# EAGLE design uO_c (EAGLE 7.5.0)
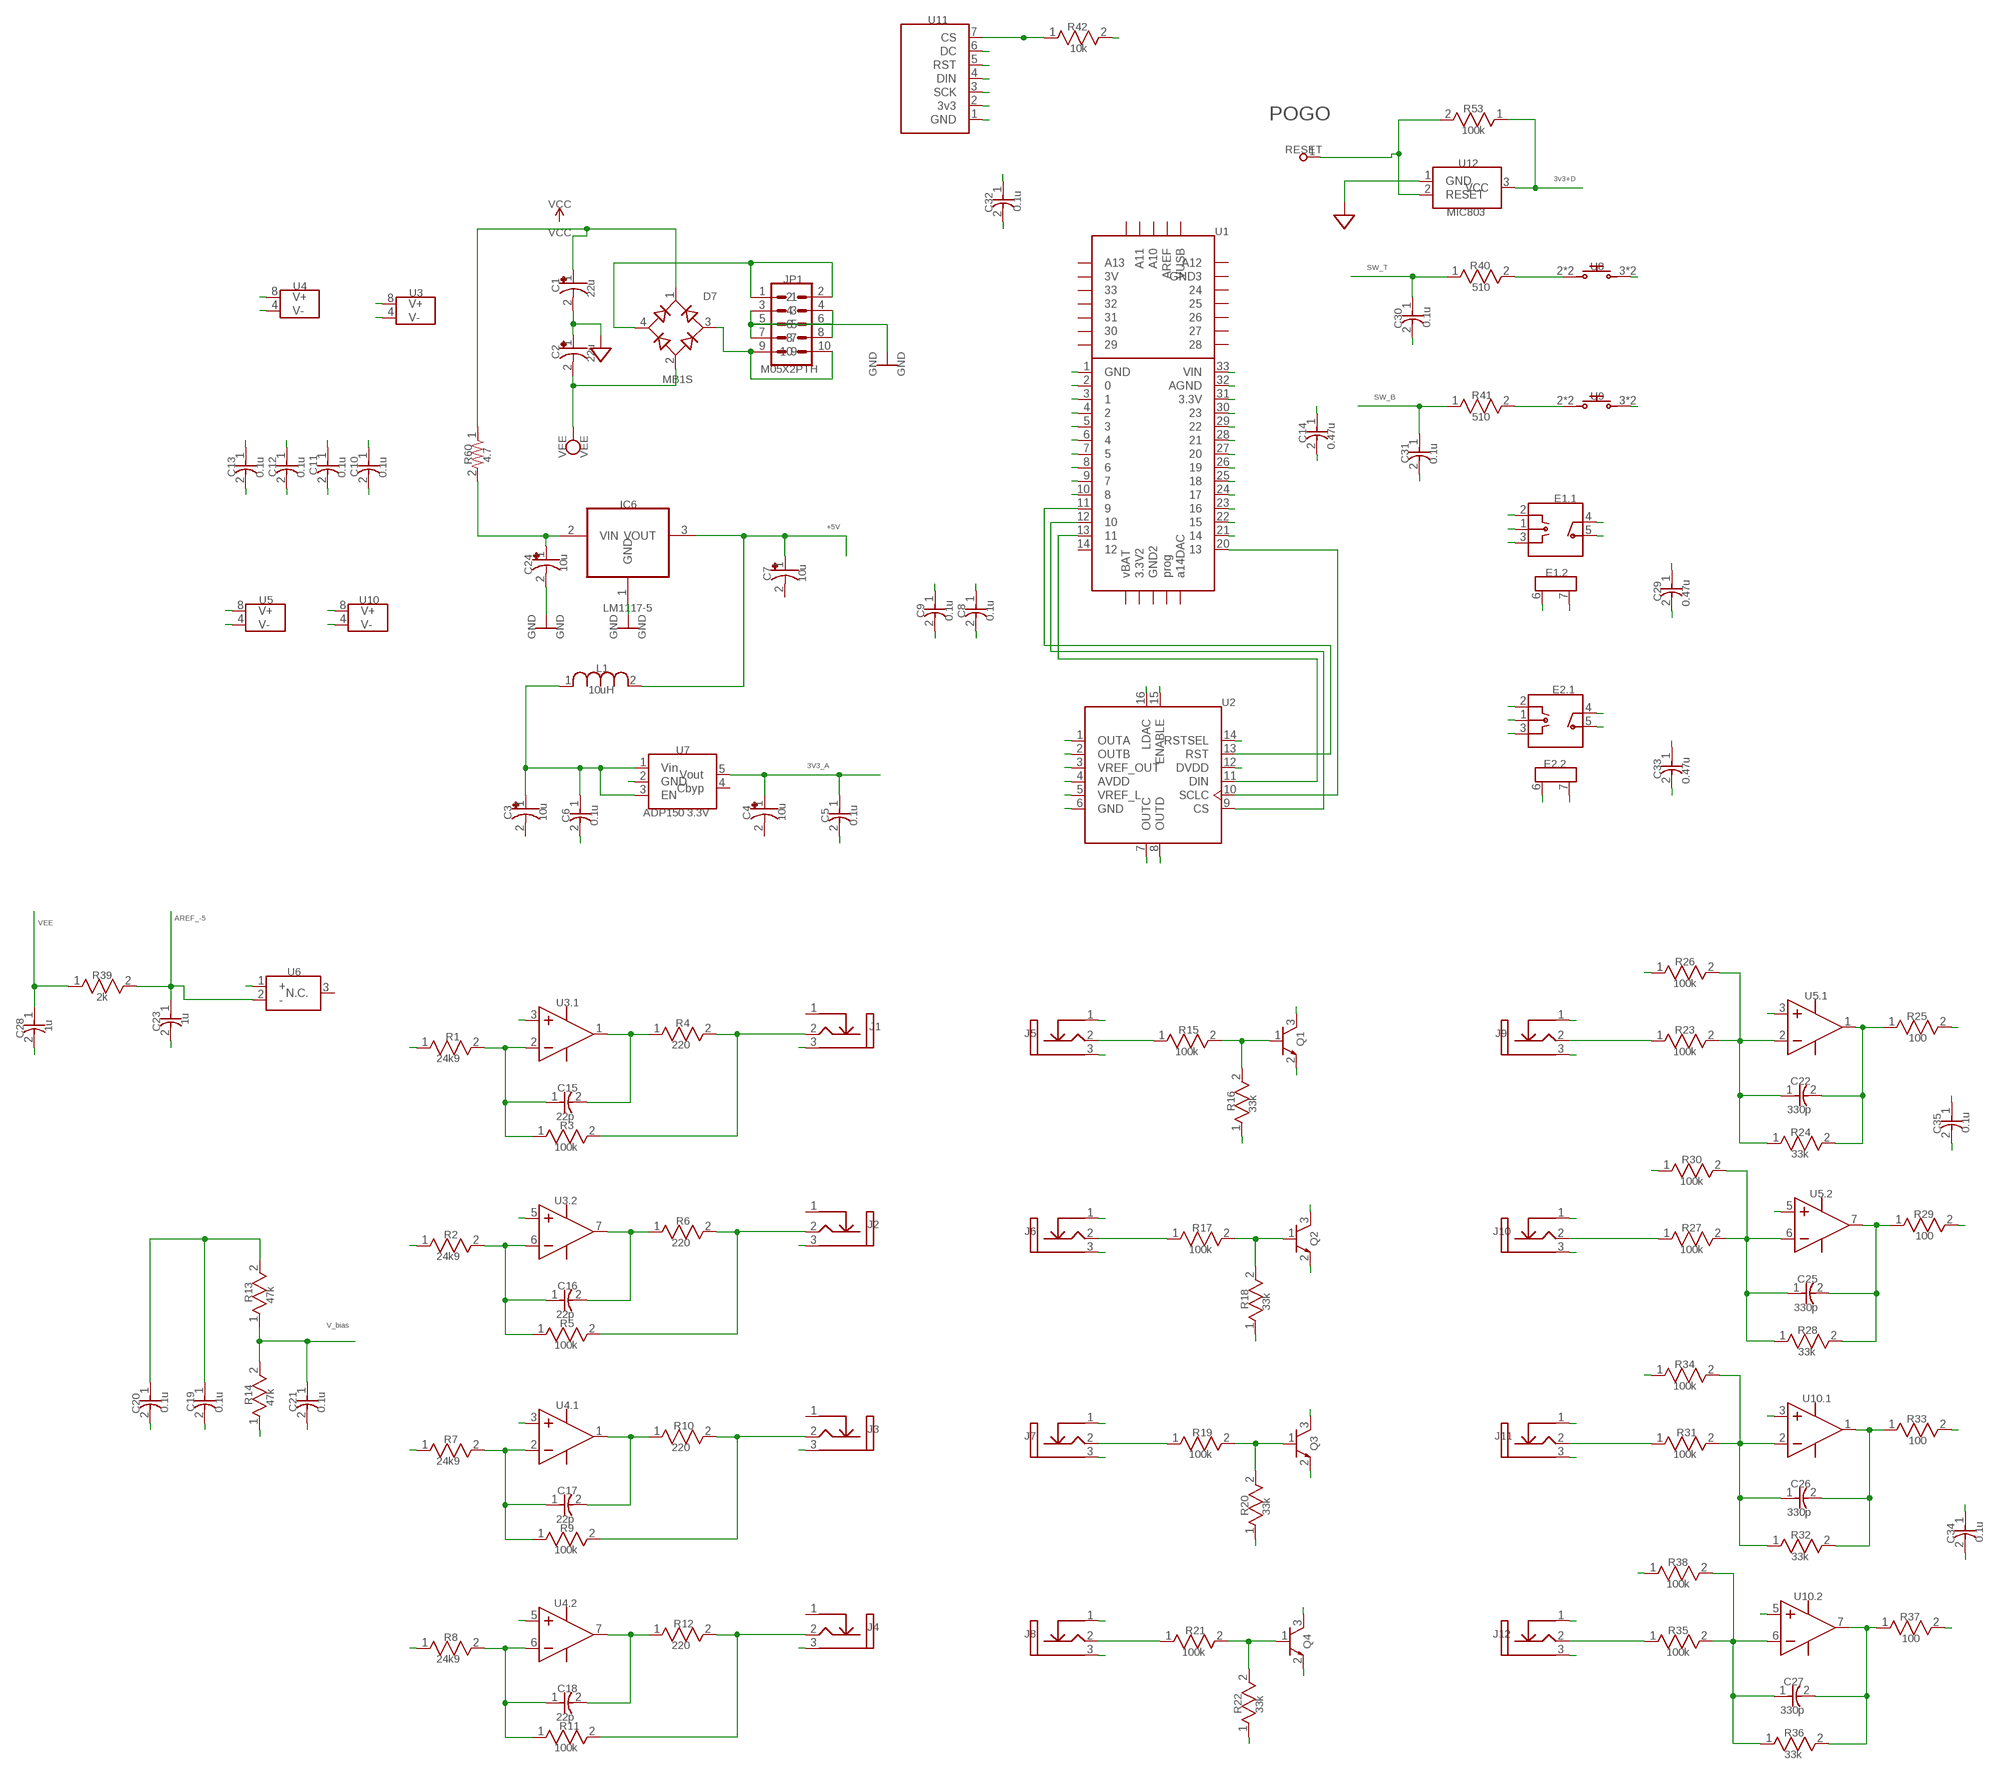
[diagram p0: schematic, sheet 1]

## Parts
C1  22u  CPOL-USC  [CAPAE-5.3X5.3H3]
C2  22u  CPOL-USC  [CAPAE-5.3X5.3H3]
C3  10u  CPOL-USC  [CAPAE-5.3X5.3H3]
C4  10u  CPOL-USC  [CAPAE-5.3X5.3H3]
C5  0.1u  CAP_0805  [CAP_0805]
C6  0.1u  CAP_0805  [CAP_0805]
C7  10u  CPOL-USC  [CAPAE-5.3X5.3H3]
C8  0.1u  CAP_0805  [CAP_0805]
C9  0.1u  CAP_0805  [CAP_0805]
C10  0.1u  CAP_0805  [CAP_0805]
C11  0.1u  CAP_0805  [CAP_0805]
C12  0.1u  CAP_0805  [CAP_0805]
C13  0.1u  CAP_0805  [CAP_0805]
C14  0.47u  CAP_0805  [CAP_0805]
C15  22p  CAP_0805  [CAP_0805]
C16  22p  CAP_0805  [CAP_0805]
C17  22p  CAP_0805  [CAP_0805]
C18  22p  CAP_0805  [CAP_0805]
C19  0.1u  CAP_0805  [CAP_0805]
C20  0.1u  CAP_0805  [CAP_0805]
C21  0.1u  CAP_0805  [CAP_0805]
C22  330p  CAP_0805  [CAP_0805]
C23  1u  CAP_0805  [CAP_0805]
C24  10u  CPOL-USC  [CAPAE-5.3X5.3H3]
C25  330p  CAP_0805  [CAP_0805]
C26  330p  CAP_0805  [CAP_0805]
C27  330p  CAP_0805  [CAP_0805]
C28  1u  CAP_0805  [CAP_0805]
C29  0.47u  CAP_0805  [CAP_0805]
C30  0.1u  CAP_0805  [CAP_0805]
C31  0.1u  CAP_0805  [CAP_0805]
C32  0.1u  CAP_0805  [CAP_0805]
C33  0.47u  CAP_0805  [CAP_0805]
C34  0.1u  CAP_0805  [CAP_0805]
C35  0.1u  CAP_0805  [CAP_0805]
D7  MB1S  [SOP-4/6.5X2.54]
E1  PEC11  [PEC11]
E2  PEC11  [PEC11]
IC6  LM1117-5  REG1117T  [TO252]
J1  THONKICONN  [THONKICONN_JACK]
J2  THONKICONN  [THONKICONN_JACK]
J3  THONKICONN  [THONKICONN_JACK]
J4  THONKICONN  [THONKICONN_JACK]
J5  THONKICONN_20  [THONKICONN_JACK]
J6  THONKICONN_20  [THONKICONN_JACK]
J7  THONKICONN_20  [THONKICONN_JACK]
J8  THONKICONN_20  [THONKICONN_JACK]
J9  THONKICONN_20  [THONKICONN_JACK]
J10  THONKICONN_20  [THONKICONN_JACK]
J11  THONKICONN_20  [THONKICONN_JACK]
J12  THONKICONN_20  [THONKICONN_JACK]
JP1  M05X2PTH  [AVR_ICSP]
L1  10uH  DEV_L1  [RES_1210]
Q1  MMBT3904  [SOT23]
Q2  MMBT3904  [SOT23]
Q3  MMBT3904  [SOT23]
Q4  MMBT3904  [SOT23]
R1  24k9  RES_0805  [RES_0805]
R2  24k9  RES_0805  [RES_0805]
R3  100k  RES_0805  [RES_0805]
R4  220  RES_0805  [RES_0805]
R5  100k  RES_0805  [RES_0805]
R6  220  RES_0805  [RES_0805]
R7  24k9  RES_0805  [RES_0805]
R8  24k9  RES_0805  [RES_0805]
R9  100k  RES_0805  [RES_0805]
R10  220  RES_0805  [RES_0805]
R11  100k  RES_0805  [RES_0805]
R12  220  RES_0805  [RES_0805]
R13  47k  RES_0805  [RES_0805]
R14  47k  RES_0805  [RES_0805]
R15  100k  RES_0805  [RES_0805]
R16  33k  RES_0805  [RES_0805]
R17  100k  RES_0805  [RES_0805]
R18  33k  RES_0805  [RES_0805]
R19  100k  RES_0805  [RES_0805]
R20  33k  RES_0805  [RES_0805]
R21  100k  RES_0805  [RES_0805]
R22  33k  RES_0805  [RES_0805]
R23  100k  RES_0805  [RES_0805]
R24  33k  RES_0805  [RES_0805]
R25  100  RES_0805  [RES_0805]
R26  100k  RES_0805  [RES_0805]
R27  100k  RES_0805  [RES_0805]
R28  33k  RES_0805  [RES_0805]
R29  100  RES_0805  [RES_0805]
R30  100k  RES_0805  [RES_0805]
R31  100k  RES_0805  [RES_0805]
R32  33k  RES_0805  [RES_0805]
R33  100  RES_0805  [RES_0805]
R34  100k  RES_0805  [RES_0805]
R35  100k  RES_0805  [RES_0805]
R36  33k  RES_0805  [RES_0805]
R37  100  RES_0805  [RES_0805]
R38  100k  RES_0805  [RES_0805]
R39  2k  RES_0805  [RES_0805]
R40  510  RES_0805  [RES_0805]
R41  510  RES_0805  [RES_0805]
R42  10k  RES_0805  [RES_0805]
R53  100k  RES_0603  [RES_0805]
R60  4.7  R-US_R1206  [R1206]
RESET  RESET  [ROUND-ROUND]
U1  TEENSY_3.1_EDGE  [TEENSY3.1_EDGE]
U2  DAC8565  [TSSOP-16]
U3  OPA2172  [SOIC-8/150MIL]
U4  OPA2172  [SOIC-8/150MIL]
U5  MCP6002  [SOIC-8/150MIL]
U6  LM4040_EM3-5.0  [SOT23]
U7  ADP150 3.3V  ADP150_3.3V  [SOT23-5]
U8  6MM_TACTILE_SW  [TL1105SP]
U9  6MM_TACTILE_SW  [TL1105SP]
U10  MCP6002  [SOIC-8/150MIL]
U11  1306_DISP_O_C  [1306_DISP_O_C]
U12  MIC803  MIC803_SUPERVISOR  [SOT23]

## Nets
3v3+D: C8.1 C14.1 C32.1 R42.2 R53.1 U1.31(3.3V) U2.12(DVDD) U11.2(3v3) U12.3(VCC)
3V3_A: C4.1(+) C5.1 C9.1 C34.1 C35.1 U2.4(AVDD) U5.8(VCC_AND_GND:V+) U7.5(Vout) U10.8(VCC_AND_GND:V+)
+5V: C7.1(+) IC6.3(VOUT) L1.2 U1.33(VIN)
AREF_-5: C23.1 R26.1 R30.1 R34.1 R38.1 R39.2 U6.2(-)
CS_DAC: U1.12 U2.9(CS)
CS_OLED: R42.1 U1.10 U11.7(CS)
CV_1: R25.2 U1.26
CV_2: R29.2 U1.25
CV_3: R33.2 U1.27
CV_4: R37.2 U1.24
CV_A: R1.1 U2.1(OUTA)
CV_B: R2.1 U2.2(OUTB)
CV_C: R7.1 U2.7(OUTC)
CV_D: R8.1 U2.8(OUTD)
DC: U1.8 U11.6(DC)
DOUT: U1.13 U2.11(DIN) U11.4(DIN)
ENC_L1: E1.2 U1.29
ENC_L2: E1.3 U1.28
ENC_R1: E2.2 U1.22
ENC_R2: E2.3 U1.23
GND [NetClass1]: C1.2(-) C2.1(+) C3.2(-) C4.2(-) C5.2 C6.2 C7.2(-) C8.2 C9.2 C10.2 C11.2 C12.1 C13.1 C14.2 C19.2 C20.2 C21.2 C23.2 C24.2(-) C28.2 C29.2 C30.2 C31.2 C32.2 C33.2 C34.2 C35.2 E1.1 E1.5 E1.6(PART_2:gnd) E1.7(PART_2:gnd) E2.1 E2.5 E2.6(PART_2:gnd) E2.7(PART_2:gnd) IC6.1(GND) J1.3(GND) J2.3(GND) J3.3(GND) J4.3(GND) J5.1(TN) J5.3(GND) J6.1(TN) J6.3(GND) J7.1(TN) J7.3(GND) J8.1(TN) J8.3(GND) J9.1(TN) J9.3(GND) J10.1(TN) J10.3(GND) J11.1(TN) J11.3(GND) J12.1(TN) J12.3(GND) JP1.3 JP1.4 JP1.5 JP1.6 JP1.7 JP1.8 Q1.2((E)) Q2.2((E)) Q3.2((E)) Q4.2((E)) R14.1 R16.1 R18.1 R20.1 R22.1 U1.1(GND) U1.32(AGND) U2.5(VREF_L) U2.6(GND) U2.14(RSTSEL) U2.15(ENABLE) U2.16(LDAC) U5.3(PART_1:IN+) U5.4(VCC_AND_GND:V-) U5.5(PART_2:IN+) U6.1(+) U7.2(GND) U8.3 U8.4 U9.3 U9.4 U10.3(PART_1:IN+) U10.4(VCC_AND_GND:V-) U10.5(PART_2:IN+) U11.1(GND) U12.1(GND) ; supply symbol labelled 22u, GNDANALOG
N$64: D7.3(AC2) JP1.9 JP1.10
Net_0: J2.2(Tip) R5.2 R6.2
Net_1: C16.1 R2.2 R5.1 U3.6(PART_2:IN-)
Net_2: C16.2 R6.1 U3.7(PART_2:OUT)
Net_3: J3.2(Tip) R9.2 R10.2
Net_4: C17.1 R7.2 R9.1 U4.2(PART_1:IN-)
Net_5: C17.2 R10.1 U4.1(PART_1:OUT)
Net_6: J4.2(Tip) R11.2 R12.2
Net_7: C18.1 R8.2 R11.1 U4.6(PART_2:IN-)
Net_8: C18.2 R12.1 U4.7(PART_2:OUT)
Net_9: Q2.1((B)) R17.2 R18.2
Net_10: Q3.1((B)) R19.2 R20.2
Net_11: Q4.1((B)) R21.2 R22.2
Net_12: C25.1 R27.2 R28.1 R30.2 U5.6(PART_2:IN-)
Net_13: C3.1(+) C6.1 L1.1 U7.1(Vin) U7.3(EN)
Net_18: C26.1 R31.2 R32.1 R34.2 U10.2(PART_1:IN-)
Net_19: J1.2(Tip) R3.2 R4.2
Net_20: C15.1 R1.2 R3.1 U3.2(PART_1:IN-)
Net_21: C15.2 R4.1 U3.1(PART_1:OUT)
Net_22: C27.1 R35.2 R36.1 R38.2 U10.6(PART_2:IN-)
Net_35: Q1.1((B)) R15.2 R16.2
Net_39: J8.2(Tip) R21.1
Net_40: J7.2(Tip) R19.1
Net_41: J6.2(Tip) R17.1
Net_42: J5.2(Tip) R15.1
Net_43: C22.1 R23.2 R24.1 R26.2 U5.2(PART_1:IN-)
Net_48: C27.2 R36.2 R37.1 U10.7(PART_2:OUT)
Net_49: C26.2 R32.2 R33.1 U10.1(PART_1:OUT)
Net_50: C25.2 R28.2 R29.1 U5.7(PART_2:OUT)
Net_51: C22.2 R24.2 R25.1 U5.1(PART_1:OUT)
Net_52: J9.2(Tip) R23.1
Net_53: J10.2(Tip) R27.1
Net_54: J11.2(Tip) R31.1
Net_55: J12.2(Tip) R35.1
Net_73: C24.1(+) IC6.2(VIN) R60.2
Net_75: R41.2 U9.1 U9.2
Net_76: R40.2 U8.1 U8.2
Net_88: R53.2 RESET.1 U12.2(RESET)
Net_107: D7.4(AC1) JP1.1 JP1.2
RST: U1.9 U11.5(RST)
RST_DAC: U1.11 U2.13(RST)
SCK: U1.20 U2.10(SCLC) U11.3(SCK)
SW_B: C31.1 R41.1 U1.6
SW_L: C29.1 E1.4 U1.30
SW_R: C33.1 E2.4 U1.21
SW_T: C30.1 R40.1 U1.7
TR1: Q1.3((C)) U1.2
TR2: Q2.3((C)) U1.3
TR3: Q3.3((C)) U1.4
TR4: Q4.3((C)) U1.5
V_bias: C21.1 R13.1 R14.2 U3.3(PART_1:IN+) U3.5(PART_2:IN+) U4.3(PART_1:IN+) U4.5(PART_2:IN+)
VCC: C1.1(+) C10.1 C11.1 D7.1(+) R60.1 U3.8(VCC_AND_GND:V+) U4.8(VCC_AND_GND:V+)
VEE: C2.2(-) C12.2 C13.2 C28.1 D7.2(-) R39.1 U3.4(VCC_AND_GND:V-) U4.4(VCC_AND_GND:V-)
VREF_2v5: C19.1 C20.1 R13.2 U2.3(VREF_OUT)
Unconnected: J1.1(TN) J2.1(TN) J3.1(TN) J4.1(TN) U1.14 U6.3(N.C.) U7.4(Cbyp)

## Notes on the sheet
- U11
- R42
- 10k
- POGO
- R53
- 100k
- RESET
- U12
- 3v3+D
- VCC | MIC803
- C32 | 0.1u
- VCC
- U1
- SW_T
- R40 | U8
- JP1 | 510
- U4 | C1
- U3 | 22u
- D7
- C30 | 0.1u
- C2
- 22u
- M05X2PTH
- MB1S | GND | GND
- SW_B
- R41 | U9
- 510
- C14
- 0.47u
- VEE | VEE
- R60 | 4.7 | C31 | 0.1u
- C13 | 0.1u | C12 | 0.1u | C11 | 0.1u | C10 | 0.1u
- E1.1
- IC6
- +5V
- C24 | 10u
- E1.2
- C7 | 10u
- U5 | U10 | LM1117-5 | C29
- 0.47u
- C9 | C8
- 0.1u | 0.1u
- GND | GND | GND | GND
- L1
- 10uH
- E2.1
- U2
- U7
- 3V3_A
- E2.2
- C33
- 0.47u
- ADP150 3.3V
- C3 | 10u | C6 | C4 | 10u | C5
- 0.1u | 0.1u
- AREF_-5
- VEE
- R26
- U6
- R39 | 100k
- 2k
- U5.1
- U3.1
- R25
- 1u | R4
- 1u | C23 | J1
- R15 | R23 | 100
- C28 | J5 | J9
- R1 | 220
- 100k | Q1 | 100k
- 24k9
- C22
- C15
- 330p
- 22p | R16 | 33k
- R3
- C35 | 0.1u
- R24
- 100k
- 33k
- R30
- 100k
- U5.2
- U3.2
- R29
- R6
- J2
- R17 | R27 | 100
- J6 | J10
- R2 | 220
- 100k | Q2 | 100k
- 24k9
- C25
- C16
- R13 | 47k | 330p
- 22p | R18 | 33k
- V_bias
- R5
- R28
- 100k
- 33k
- R34
- 100k
- R14 | U10.1
- 47k
- C19 | C21 | U4.1
- C20 | 0.1u | 0.1u | 0.1u
- R33
- R10
- J3
- R19 | R31 | 100
- J7 | J11
- R7 | 220
- 100k | Q3 | 100k
- 24k9
- C26
- C17
- 330p
- 22p | R20 | 33k
- R9
- R32
- C34 | 0.1u
- 100k
- 33k
- R38
- 100k
- U10.2
- U4.2
- R37
- R12
- J4
- R21 | R35 | 100
- J8 | J12
- R8 | 220
- 100k | Q4 | 100k
- 24k9
- C27
- C18
- 330p
- 22p | R22 | 33k
- R11
- R36
- 100k
- 33k

## Library data of the parts
C1 C2 = common:CPOL-USC
C3 C4 C7 C24 = common:CPOL-USC; VALUE: 22u
C5 C6 C8-C13 C19-C21 C30-C32 C34 C35 = common:CAP_0805
C14-C18 C22 C23 C25-C29 C33 = common:CAP_0805; VALUE: 0.1u
D7 = common:MB1S
E1 E2 = common:PEC11
IC6 = common:REG1117T
J1-J4 = common:THONKICONN
J5-J12 = common:THONKICONN_20
JP1 = common:M05X2PTH
L1 = common:DEV_L1
Q1-Q4 = common:MMBT3904; DATASHEET: http://datasheets.diptrace.com/philips-nxp/MMBT3904.pdf; MANUFACTURER: NXP-Philips
R1 R2 R7 R8 = common:RES_0805
R3-R6 R9-R42 = common:RES_0805; VALUE: 24k9
R53 = common:RES_0603
R60 = common:R-US_R1206
RESET = common:RESET
U1 = common:TEENSY_3.1_EDGE; MANUFACTURER: PJRC
U2 = common:DAC8565
U3 U4 = common:OPA2172; MANUFACTURER: Motorola
U5 U10 = common:MCP6002; MANUFACTURER: Motorola
U6 = common:LM4040_EM3-5.0; DATASHEET: http://datasheets.diptrace.com/maxim/LM4040-LM4040D.pdf; MANUFACTURER: Maxim
U7 = common:ADP150_3.3V; MANUFACTURER: analog
U8 U9 = common:6MM_TACTILE_SW
U11 = common:1306_DISP_O_C
U12 = common:MIC803_SUPERVISOR

## Net classes
1 NetClass1: width 0.305 mm, clearance 0.152 mm

## Board
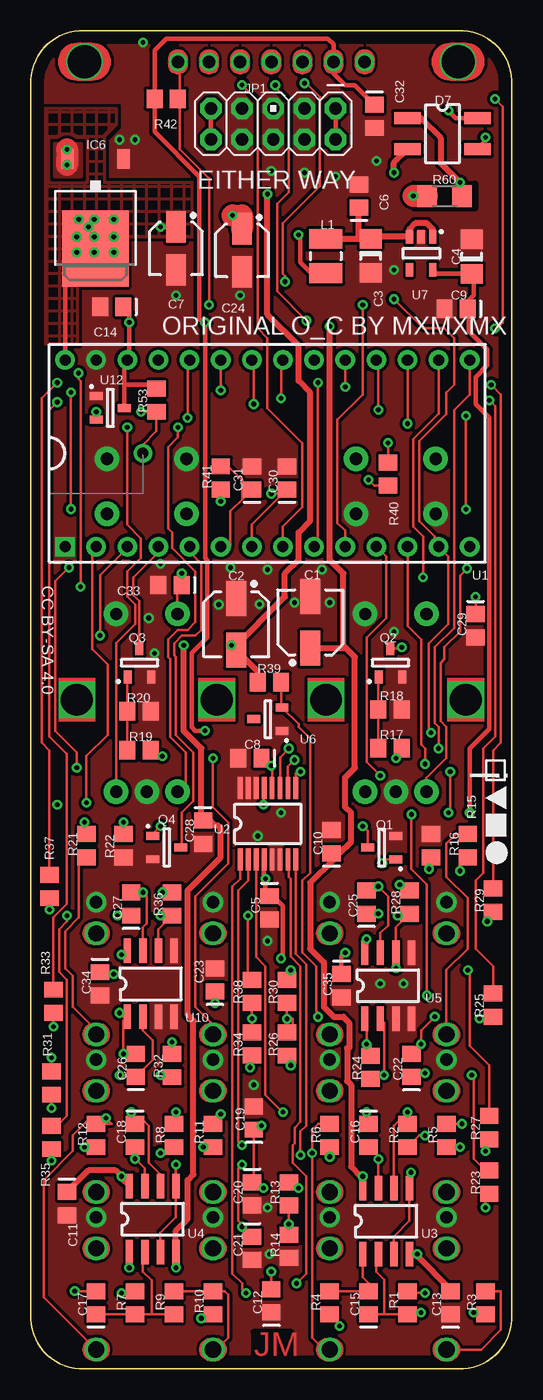
[diagram p1: board, top side]
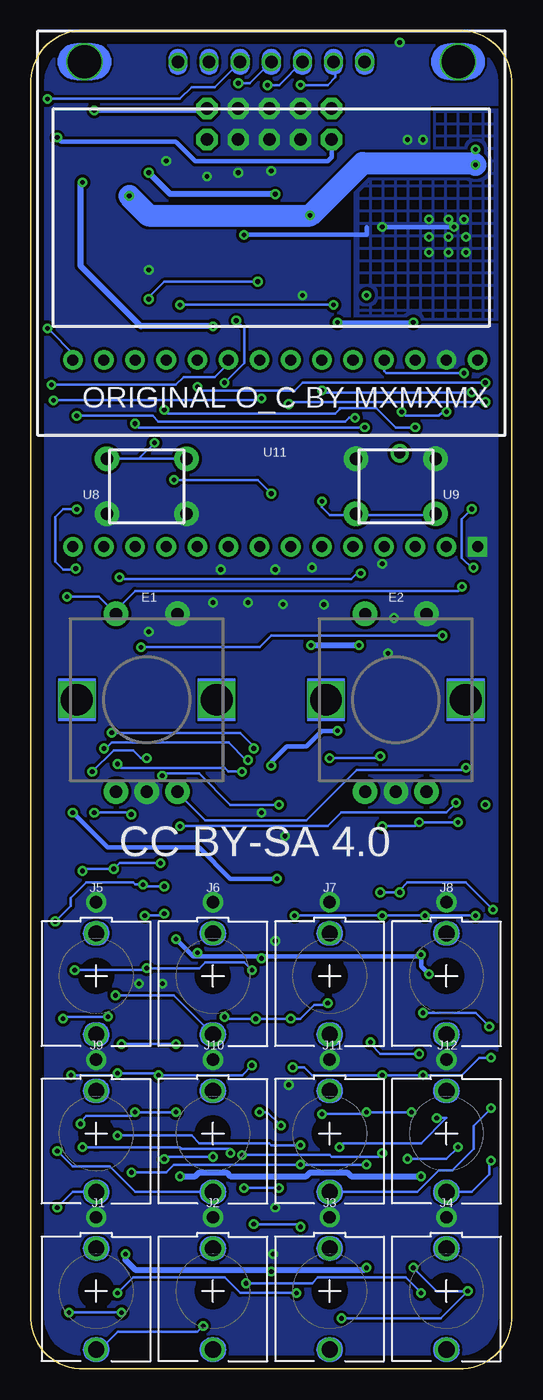
[diagram p2: board, bottom side, seen from below]

Size 39.27 x 109.22 mm. Coordinates in mm from the lower left corner, seen from the top.
Outline: 0,4.45 arc94 4.39,0 34.87,0 arc94 39.27,4.45 39.27,104.78 arc94 34.87,109.22 4.39,109.22 arc94 0,104.78 0,4.45
Copper layers (1*16): Top 0.035mm / dielectric 1.5mm / Bottom 0.035mm
Design rules "default *": minimum track width 10mil, minimum drill 0.61mm, track to track 8mil, track to pad 8mil, pad to pad 8mil, via to via 8mil, smd to smd 8mil, copper to edge 40mil, drill to drill 8mil, minimum pad ring 0mil, minimum via ring 8mil, stop-mask expansion 2mil, vias tented up to drill 15mil, thermal gap 10mil

### Footprints (pad centres in the part's own frame; a part is rotated, then mirrored left to right if it is on the bottom)
CAPAE-5.3x5.3h3 = smd 2.85 x 1.65: 1 -2.1,0; 2 2.1,0
CAPAE-5.3x5.3h3_C2 = smd 2.85 x 1.65: 1 -2.1,0; 2 2.1,0
CAP_1206 = smd 1.6 x 1.8: 1 -1.4,0; 2 1.4,0
CAP_1206_C4 = smd 1.6 x 1.8: 1 -1.4,0; 2 1.4,0
CAP_0805 = smd 1.3 x 1.5: 1 -0.95,0; 2 0.95,0
CAP_0805_C6 = smd 1.3 x 1.5: 1 -0.95,0; 2 0.95,0
CAPAE-4.3x4.3h5.4 = smd 2.55 x 1.6: 1 -1.75,0; 2 1.75,0
CAP_0805_C10 = smd 1.3 x 1.5: 1 -0.95,0; 2 0.95,0
CAP_0805_C11 = smd 1.3 x 1.5: 1 -0.95,0; 2 0.95,0
CAP_0805_C14 = smd 1.3 x 1.5: 1 -0.95,0; 2 0.95,0
CAP_0805_C23 = smd 1.3 x 1.5: 1 -0.95,0; 2 0.95,0
CAPAE-4.3x4.3h5.4_C24 = smd 2.55 x 1.6: 1 -1.75,0; 2 1.75,0
CAP_0805_C32 = smd 1.3 x 1.5: 1 -0.95,0; 2 0.95,0
CAP_0805_C33 = smd 1.3 x 1.5: 1 -0.95,0; 2 0.95,0
SOP-4/6.5x2.54 = smd 2.2 x 1: 1 -2.855,1.27; 2 -2.855,-1.27; 3 2.855,-1.27; 4 2.855,1.27
PEC11 = drill 1 pad 2: 1 0,-7.5; 2 -2.5,-7.5; 3 2.5,-7.5; 4 -2.5,7; 5 2.5,7 | drill 2.6 pad 3 square: 6 5.7,0; 7 -5.7,0
TO252 = smd 1 x 1.6: 1 -2.28,-4.8; 2 2.28,-4.8 | smd 5.4 x 6.2: 3 0,2.5
Thonkiconn_Jack = drill 1.321 pad 1.905: 1 0,3.48; 2 0,-4.775 | drill 1.016 pad 1.651: 3 0,6.02
AVR_ICSP = drill 1.016 pad 1.737 octagon: 1 -1.27,5.08; 2 1.27,5.08; 3 -1.27,2.54; 4 1.27,2.54; 5 -1.27,0; 6 1.27,0; 7 -1.27,-2.54; 8 1.27,-2.54; 9 -1.27,-5.08; 10 1.27,-5.08
RES_1210 = smd 1.6 x 2.7: 1 -1.4,0; 2 1.4,0
Pad = drill 2.7 pad 3: 1 0,0
SOT23 = smd 1.05 x 0.65: 1 -1.15,0.95; 2 -1.15,-0.95; 3 1.15,0
SOT23_Q2 = smd 1.05 x 0.65: 1 -1.15,0.95; 2 -1.15,-0.95; 3 1.15,0
SOT23_Q4 = smd 1.05 x 0.65: 1 -1.15,0.95; 2 -1.15,-0.95; 3 1.15,0
RES_0805 = smd 1.3 x 1.5: 1 -0.95,0; 2 0.95,0
RES_0805_R2 = smd 1.3 x 1.5: 1 -0.95,0; 2 0.95,0
RES_0805_R15 = smd 1.3 x 1.5: 1 -0.95,0; 2 0.95,0
RES_0805_R16 = smd 1.3 x 1.5: 1 -0.95,0; 2 0.95,0
RES_0805_R31 = smd 1.3 x 1.5: 1 -0.95,0; 2 0.95,0
RES_0805_R35 = smd 1.3 x 1.5: 1 -0.95,0; 2 0.95,0
RES_0805_R40 = smd 1.3 x 1.5: 1 -0.95,0; 2 0.95,0
R1206 = smd 1.6 x 1.803: 1 -1.422,0; 2 1.422,0
Round-Round = drill 0.9 pad 1.5: 1 0,0
Teensy3.1_edge = drill 0.9 pad 1.6 square: 1 -7.62,15.24 | drill 0.9 pad 1.6: 2 -7.62,12.7; 3 -7.62,10.16; 4 -7.62,7.62; 5 -7.62,5.08; 6 -7.62,2.54; 7 -7.62,0; 8 -7.62,-2.54; 9 -7.62,-5.08; 10 -7.62,-7.62; 11 -7.62,-10.16; 12 -7.62,-12.7; 13 -7.62,-15.24; 14 -7.62,-17.78; 20 7.62,-17.78; 21 7.62,-15.24; 22 7.62,-12.7; 23 7.62,-10.16; 24 7.62,-7.62; 25 7.62,-5.08; 26 7.62,-2.54; 27 7.62,0; 28 7.62,2.54; 29 7.62,5.08; 30 7.62,7.62; 31 7.62,10.16; 32 7.62,12.7; 33 7.62,15.24
TSSOP-16 = smd 1.8 x 0.4: 1 -2.9,2.275; 2 -2.9,1.625; 3 -2.9,0.975; 4 -2.9,0.325; 5 -2.9,-0.325; 6 -2.9,-0.975; 7 -2.9,-1.625; 8 -2.9,-2.275; 9 2.9,-2.275; 10 2.9,-1.625; 11 2.9,-0.975; 12 2.9,-0.325; 13 2.9,0.325; 14 2.9,0.975; 15 2.9,1.625; 16 2.9,2.275
SOIC-8/150mil = smd 2 x 0.6: 1 -2.7,1.905; 2 -2.7,0.635; 3 -2.7,-0.635; 4 -2.7,-1.905; 5 2.7,-1.905; 6 2.7,-0.635; 7 2.7,0.635; 8 2.7,1.905
SOT23_U6 = smd 1.05 x 0.65: 1 -1.15,0.95; 2 -1.15,-0.95; 3 1.15,0
SOT23-5 = smd 1.1 x 0.6: 1 -1.35,0.95; 2 -1.35,0; 3 -1.35,-0.95; 4 1.35,-0.95; 5 1.35,0.95
TL1105SP = drill 1 pad 2: 1 -2.25,3.25; 2 -2.25,-3.25; 3 2.25,3.25; 4 2.25,-3.25
TL1105SP_U9 = drill 1 pad 2: 1 -2.25,3.25; 2 -2.25,-3.25; 3 2.25,3.25; 4 2.25,-3.25
SOIC-8/150mil_U10 = smd 2 x 0.6: 1 -2.7,1.905; 2 -2.7,0.635; 3 -2.7,-0.635; 4 -2.7,-1.905; 5 2.7,-1.905; 6 2.7,-0.635; 7 2.7,0.635; 8 2.7,1.905
1306_disp_O_C = drill 1.016 pad 1.524: 1 -7.62,2.54; 2 -5.08,2.54; 3 -2.54,2.54; 4 0,2.54; 5 2.54,2.54; 6 5.08,2.54; 7 7.62,2.54

### Placement (x,y rotation side)
C1  22u  [CAPAE-5.3x5.3h3]  22.81,60.92 90 top
C2  22u  [CAPAE-5.3x5.3h3_C2]  16.78,60.77 270 top
C3  10u  [CAP_1206]  27.73,90.83 270 top
C4  10u  [CAP_1206_C4]  35.99,90.78 90 top
C5  19.48,37.63 270 top
C6  0.1u  [CAP_0805_C6]  26.78,95.71 90 top
C7  10u  [CAPAE-4.3x4.3h5.4]  11.86,91.44 270 top
C8  17.89,49.85 180 top
C9  34.71,86.52 180 top
C10  0.1u  [CAP_0805_C10]  24.56,43.02 90 top
C11  0.1u  [CAP_0805_C11]  2.97,13.49 270 top
C12  0.1u  [CAP_0805_C10]  19.63,5.55 90 top
C13  0.1u  [CAP_0805_C10]  34.24,5.4 90 top
C14  0.47u  [CAP_0805_C14]  6.61,86.68 180 top
C15  22p  [CAP_0805_C10]  27.57,5.4 90 top
C16  27.57,19.05 270 top
C17  22p  [CAP_0805_C10]  5.35,5.4 90 top
C18  8.52,19.05 270 top
C19  0.1u  [CAP_0805_C10]  18.21,20.48 90 top
C20  18.05,14.29 270 top
C21  18.05,9.85 270 top
C22  330p  [CAP_0805_C10]  31.07,24.77 90 top
C23  1u  [CAP_0805_C23]  15.03,31.75 90 top
C24  10u  [CAPAE-4.3x4.3h5.4_C24]  17.26,91.28 270 top
C25  330p  [CAP_0805_C10]  27.42,38.1 90 top
C26  330p  [CAP_0805_C10]  8.58,24.78 90 top
C27  330p  [CAP_0805_C10]  8.2,37.94 90 top
C28  14.08,43.81 270 top
C29  36.3,60.64 270 top
C30  0.1u  [CAP_0805_C10]  20.9,72.7 90 top
C31  0.1u  [CAP_0805_C10]  18.05,72.7 90 top
C32  0.1u  [CAP_0805_C32]  28.05,102.23 270 top
C33  0.47u  [CAP_0805_C33]  11.38,63.97 180 top
C34  5.66,31.43 270 top
C35  25.35,31.28 270 top
D7  MB1S  [SOP-4/6.5x2.54]  33.6,100.81 0 top
E1  29.79,54.61 0 bottom
E2  9.47,54.61 0 bottom
IC6  5.29,93.94 180 top
J1  THONKICONN  [Thonkiconn_Jack]  33.92,6.35 0 bottom
J2  THONKICONN  [Thonkiconn_Jack]  24.4,6.35 0 bottom
J3  THONKICONN  [Thonkiconn_Jack]  14.87,6.35 0 bottom
J4  THONKICONN  [Thonkiconn_Jack]  5.35,6.35 0 bottom
J5  THONKICONN  [Thonkiconn_Jack]  33.92,32.07 0 bottom
J6  THONKICONN  [Thonkiconn_Jack]  24.4,32.07 0 bottom
J7  THONKICONN  [Thonkiconn_Jack]  14.87,32.07 0 bottom
J8  THONKICONN  [Thonkiconn_Jack]  5.35,32.07 0 bottom
J9  THONKICONN  [Thonkiconn_Jack]  33.92,19.21 0 bottom
J10  THONKICONN  [Thonkiconn_Jack]  24.4,19.21 0 bottom
J11  THONKICONN  [Thonkiconn_Jack]  14.87,19.21 0 bottom
J12  THONKICONN  [Thonkiconn_Jack]  5.35,19.21 0 bottom
JP1  19.79,101.6 270 top
L1  24.08,90.82 270 top
Pad1  PAD  [Pad]  34.87,106.68 0 top
Pad2  PAD  [Pad]  4.39,106.68 0 top
Q1  28.64,42.54 180 top
Q2  MMBT3904  [SOT23_Q2]  29.36,57.63 90 top
Q3  MMBT3904  [SOT23_Q2]  8.88,57.63 90 top
Q4  MMBT3904  [SOT23_Q4]  11.1,42.55 0 top
R1  30.75,5.4 270 top
R2  24k9  [RES_0805_R2]  30.75,19.05 90 top
R3  100k  [RES_0805_R2]  37.1,5.4 90 top
R4  24.4,5.4 270 top
R5  33.92,19.05 270 top
R6  220  [RES_0805_R2]  24.4,19.05 90 top
R7  8.52,5.4 270 top
R8  24k9  [RES_0805_R2]  11.7,19.05 90 top
R9  100k  [RES_0805_R2]  11.7,5.4 90 top
R10  220  [RES_0805_R2]  14.87,5.4 90 top
R11  14.87,19.05 270 top
R12  220  [RES_0805_R2]  5.35,19.05 90 top
R13  47k  [RES_0805_R2]  21.06,14.29 90 top
R14  47k  [RES_0805_R2]  21.06,10 90 top
R15  100k  [RES_0805_R15]  35.67,42.7 270 top
R16  33k  [RES_0805_R16]  32.65,42.7 270 top
R17  29.32,50.64 180 top
R18  29.32,53.82 180 top
R19  8.84,50.48 180 top
R20  8.84,53.66 180 top
R21  100k  [RES_0805_R2]  4.55,42.7 90 top
R22  33k  [RES_0805_R2]  7.57,42.7 90 top
R23  100k  [RES_0805_R2]  37.41,15.24 90 top
R24  33k  [RES_0805_R2]  27.73,24.6 90 top
R25  100  [RES_0805_R2]  37.73,29.69 90 top
R26  75k  [RES_0805]  20.9,26.51 270 top
R27  100k  [RES_0805_R2]  37.41,19.69 90 top
R28  33k  [RES_0805_R2]  30.91,38.1 90 top
R29  100  [RES_0805_R2]  37.73,38.26 90 top
R30  75k  [RES_0805_R2]  20.9,30.8 90 top
R31  100k  [RES_0805_R31]  1.7,23.33 90 top
R32  33k  [RES_0805_R2]  11.54,24.76 90 top
R33  100  [RES_0805_R31]  1.85,30 90 top
R34  75k  [RES_0805]  18.05,26.52 270 top
R35  100k  [RES_0805_R35]  1.7,18.89 90 top
R36  33k  [RES_0805_R2]  11.54,37.94 90 top
R37  100  [RES_0805_R31]  1.54,39.37 90 top
R38  75k  [RES_0805_R2]  18.05,30.81 90 top
R39  2k  [RES_0805_R2]  19.48,56.04 0 top
R40  510  [RES_0805_R40]  29.16,73.02 90 top
R41  15.51,72.71 270 top
R42  10k  [RES_0805_R16]  11.06,103.65 180 top
R53  10.27,79.06 270 top
R60  33.77,95.72 180 top
RESET  RESET  [Round-Round]  9.16,74.73 90 top
U1  TEENSY 3.1_EDGE  [Teensy3.1_edge]  18.05,74.72 90 top
U2  19.37,44.49 90 top
U3  OPA2172  [SOIC-8/150mil]  29,12.07 90 top
U4  OPA2172  [SOIC-8/150mil]  9.95,12.23 90 top
U5  MCP6002  [SOIC-8/150mil]  29.16,31.28 90 top
U6  LM4040_EM3-5.0  [SOT23_U6]  19.36,53.03 180 top
U7  31.86,91.04 270 top
U8  6MM TACTILE SW  [TL1105SP]  29.79,72.03 270 bottom
U9  6MM TACTILE SW  [TL1105SP_U9]  9.47,72.03 90 bottom
U10  MCP6002  [SOIC-8/150mil_U10]  9.79,31.43 90 top
U11  1306_DISP_O_C  [1306_disp_O_C]  19.63,104.13 0 bottom
U12  MIC803  [SOT23_Q4]  6.5,78.42 0 top

### Tracks (layer width: path | path; a pad name or v marks a point on that pad's centre or on a via)
3v3+D  (via drill 0.38 pad 0.76)
  Top 0.203: U2.12 19.7,48.99 19.63,48.99 v19.63,49.21
  Top 0.381: v14.24,52.07 13.44,52.07 13.13,52.39 13.13,58.42 14.4,59.69 14.4,66.03 14.24,66.19 14.24,85.24 | 14.24,85.24 v14.24,85.4 | 19.7,48.99 C8.1 | C14.1 8.05,86.2 v8.05,85.4 8.05,82.5 U1.31 7.65,82.1 7.65,80.33 | 14.24,85.24 13.76,85.72 13.76,97.3 10.11,100.95 R42.2 10.11,107.62 11.06,108.57 24.24,108.57 24.71,108.1 U11.2 24.71,105.72 25.67,104.76 26.46,104.76 C32.1 | U12.3 7.65,80.33 | 7.65,80.33 | 7.65,80.33 9.94,80.33 R53.1
  Bottom 0.381: v19.63,49.21 19.63,49.53 18.36,50.8 16.78,50.8 15.51,52.07 v14.24,52.07 | v14.24,85.4 v8.05,85.4
3V3_A  (via drill 0.38 pad 0.76)
  Top 0.381: U5.8 27.26,34.92 v27.41,35.08 | v7.41,33.81 7.57,33.81 U10.8 | U2.4 19,41.64 19,40.01 v19.16,40.01 19.16,38.58 C5.1 19.79,38.58 20.59,37.78 20.59,33.66 v20.43,33.5 | v35.83,45.4 35.83,50.64 37.41,52.23 37.41,77.63 36.3,78.74 36.3,80.95 37.26,81.91 37.26,83.18 35.75,84.69 35.75,87.23 | 35.75,87.23 36.14,87.63 36.14,89.53 C4.1 33.13,89.38 U7.5 | C9.1 35.75,87.23 | C35.1 25.35,33.66 v25.67,33.97 | v6.78,32.23 5.82,32.23 C34.1
  Bottom 0.381: v27.41,35.08 25.99,33.66 | 25.99,33.66 20.43,33.66 | 20.43,33.66 7.57,33.66 v7.41,33.81 7.41,32.86 v6.78,32.23 | v20.43,33.5 20.43,33.66 | v19.16,40.01 22.97,40.01 25.51,42.55 32.97,42.55 v35.83,45.4 | v25.67,33.97 25.99,33.66
+5V  (via drill 0.38 pad 0.76)
  Top 0.381: U1.33 2.81,91.27 v4.73,93.19 | v10.59,93.19 | v10.59,93.19 C7.1 | L1.2 24.08,89.53 22.81,89.53 22.02,90.32 22.02,92.39 v21.86,92.55
  Bottom 0.381: v4.73,93.19 v10.59,93.19 | v21.86,92.55 11.86,92.55 C7.1
  other vias: 3.76,92.38 6.78,91.11 5.19,92.38 6.78,92.38 5.19,91.11 3.92,93.81 3.76,91.11 6.78,93.81 5.19,93.81
  pour Bottom (isolate 0.254, rank 2, hatched): 0.55,102.74 6.33,102.74 6.33,99.24 10.7,99.24 12.84,97.4 12.84,85.68 0.55,85.68
  pour Top (isolate 0.254, rank 2, hatched): 0.55,102.9 6.97,102.9 6.97,101.48 6.01,100.53 6.01,96.86 13.32,96.86 13.32,92.35 5.14,92.35 3.79,91.01 3.79,83.63 0.71,83.63
AREF_-5  (via drill 0.38 pad 0.76)
  Top 0.203: R38.1 v18.05,28.57 R34.1 | R30.1 v20.9,28.57 21.38,28.57 21.38,27.94 R26.1 | R39.2 20.43,54.05 U6.2 21.86,52.62 21.86,52.39 22.81,51.44 22.81,40.48 22.17,39.85 22.17,33.97 23.29,32.86 23.29,29.21 23.44,29.05 v23.44,28.73 | v15.03,29.84 C23.1
  Bottom 0.203: v23.44,28.73 23.29,28.57 v20.9,28.57 v18.05,28.57 17.25,28.57 16.14,29.69 15.19,29.69 v15.03,29.84
CS_DAC  (via drill 0.38 pad 0.76)
  Top 0.203: U2.9 21.64,48.58 22.18,48.58 v22.02,48.74 | v32.17,49.37 32.17,50.64 31.86,50.95 31.86,59.53 30.75,60.64 U1.12
  Bottom 0.203: v22.02,48.74 23.13,48.74 23.45,49.05 31.86,49.05 v32.17,49.37
CS_OLED  (via drill 0.38 pad 0.76)
  Top 0.203: U1.10 25.67,68.41 25.03,69.04 25.03,77.47 27.1,79.53 v27.1,86.84 | v14.55,86.84 14.55,97.14 12.17,99.53 12.17,103.81 | 12.17,103.81 12.17,106.67 U11.7 | 12.17,103.81 R42.1
  Bottom 0.203: v27.1,86.84 v14.55,86.84
CV_1  (via drill 0.38 pad 0.76)
  Top 0.203: R25.2 37.73,32.86 36.3,34.29 36.3,39.85 36.94,40.48 36.94,50.64 37.89,51.59 37.89,78.58 v37.41,79.06 | v20.43,79.2 20.43,82.34 U1.26
  Bottom 0.203: v37.41,79.06 20.57,79.06 v20.43,79.2
CV_2  (via drill 0.38 pad 0.76)
  Top 0.203: R29.2 37.73,50.48 38.37,51.12 38.37,79.52 v37.57,80.32
  Bottom 0.203: v37.57,80.32 27.43,80.32 26.79,80.95 24.24,80.95 23.13,82.06 U1.25
CV_3  (via drill 0.38 pad 0.76)
  Top 0.203: R33.2 1.86,36.83 2.97,37.94 2.97,50.16 1.54,51.59 1.54,78.26 v2.17,78.9 | v18.21,78.74 18.21,82.19 U1.27
  Bottom 0.203: v2.17,78.9 18.05,78.9 v18.21,78.74
CV_4  (via drill 0.38 pad 0.76)
  Top 0.203: R37.2 1.54,50.48 0.9,51.12 0.9,79.22 v2.17,80.49 | v25.67,80.16 U1.24
  Bottom 0.203: v2.17,80.49 17.08,80.49 17.73,79.84 25.35,79.84 v25.67,80.16
CV_A  (via drill 0.38 pad 0.76)
  Top 0.203: U2.1 17.09,40.01 16.46,39.37 16.46,7.78 17.25,6.99 17.25,6.51 v17.57,6.19 | v32.18,6.19 30.9,6.19 R1.1
  Bottom 0.203: v17.57,6.19 22.17,6.19 23.44,7.46 30.91,7.46 v32.18,6.19
CV_B  (via drill 0.38 pad 0.76)
  Top 0.203: U2.2 17.75,39.86 16.94,39.05 16.94,18.57 v17.25,18.25 | v32.18,19.05 31.7,19.05 R2.1
  Bottom 0.203: v17.25,18.25 19.63,18.25 19.79,18.41 25.51,18.41 26.14,19.05 v32.18,19.05
CV_C  (via drill 0.38 pad 0.76)
  Top 0.203: U2.7 21.06,41.59 21.06,40.16 21.22,40.01 21.22,33.65 22.02,32.86 22.02,20.16 21.54,19.68 21.54,18.41 21.38,18.25 21.38,16.83 22.49,15.72 22.49,7.78 v21.7,6.98 | v7.41,6.19 8.37,6.19 R7.1
  Bottom 0.203: v21.7,6.98 16.3,6.98 15.82,7.46 8.68,7.46 v7.41,6.19
CV_D  (via drill 0.38 pad 0.76)
  Top 0.203: U2.8 21.64,33.87 22.49,33.02 22.49,19.84 22.02,19.37 v22.02,17.46 | v10.59,17.62 11.22,17.62 R8.1
  Bottom 0.203: v22.02,17.46 14.87,17.46 14.71,17.3 10.9,17.3 v10.59,17.62
DC  (via drill 0.38 pad 0.76)
  Top 0.203: U1.8 20.59,68.74 22.17,70.33 22.17,75.57 19.32,78.42 19.32,84.14 18.52,84.93 18.52,103.5 v17.25,104.78
  Bottom 0.203: v17.25,104.78 15.03,104.78 14.4,105.41 14.4,106.51 U11.6
DOUT  (via drill 0.38 pad 0.76)
  Top 0.203: U2.11 20.34,49.92 v21.06,50.64 | v32.65,51.91 32.49,52.06 32.49,59.21 34.08,60.8 34.08,66.31 U1.13 32.97,67.42 32.97,67.94 31.7,69.2 31.7,75.72 33.92,77.94 33.92,79.68 34.56,80.32 34.56,84.13 33.76,84.92 32.02,84.92 v29.63,87.3 | v22.33,104.92 22.49,104.92 23.6,103.81 23.6,96.51 20.59,93.49 20.59,89.38 20.75,89.22 v20.75,88.73
  Bottom 0.203: v21.06,50.64 21.06,50.8 22.18,51.91 v32.65,51.91 | U11.4 21.38,104.92 v22.33,104.92 | v20.75,88.73 28.36,88.73 29.63,87.46 v29.63,87.3
ENC_L1  (via drill 0.38 pad 0.76)
  Top 0.203: E1.2 32.3,48.22 33.92,49.85 33.92,52.38 33.45,52.86 33.45,57.63 33.76,57.94 33.76,58.9 35.03,60.17 35.03,64.76 v35.59,65.31 | v35.51,70.16 v35.51,77.79 | v12.81,77.63 12.81,82.19 U1.29
  Bottom 0.203: v35.59,65.31 35.67,65.23 36.62,65.23 37.25,65.87 37.25,69.52 36.62,70.16 v35.51,70.16 | v35.51,77.79 29.32,77.79 28.84,77.31 13.6,77.31 13.29,77.63 v12.81,77.63
ENC_L2  (via drill 0.38 pad 0.76)
  Top 0.203: v3.76,49.05 3.76,50.32 2.01,52.07 2.01,64.28 v3.12,65.39 | v3.28,70.17 v3.28,79.69 | v15.51,79.85 U1.28
  Bottom 0.203: E1.3 27.3,47.03 25.03,44.77 16.78,44.77 12.65,48.9 3.92,48.9 v3.76,49.05 | v3.12,65.39 3.2,65.31 4.08,66.19 4.08,69.37 v3.28,70.17 | v3.28,79.69 15.35,79.69 v15.51,79.85
ENC_R1  (via drill 0.38 pad 0.76)
  Top 0.203: E2.2 12.65,47.11 12.65,50.32 11.38,51.59 11.38,57.94 11.22,58.1 11.22,59.52 12.02,60.32 12.81,60.32 13.44,60.95 13.44,65.08 11.54,66.98 11.54,68.25 11.22,68.57 11.22,75.25 12.01,76.04 v12.01,76.83 | v30.75,77.15 U1.22
  Bottom 0.203: v12.01,76.83 30.43,76.83 v30.75,77.15
ENC_R2  (via drill 0.38 pad 0.76)
  Top 0.203: E2.3 6.97,59.25 8.52,60.8 8.52,62.38 7.89,63.02 7.89,65.08 9,66.19 9,67.78 7.89,68.9 v7.89,76.83 | v28.37,78.26 28.37,82.19 U1.23
  Bottom 0.203: v7.89,76.83 9.47,76.83 11.06,78.42 14.03,78.42 14.03,78.31 14.4,77.95 28.05,77.95 v28.37,78.26
GND  (via drill 0.38 pad 0.76)
  other vias: 19.32,34.93 18.21,23.18 19.32,13.18 19.48,9.37 16.3,65.39 19.32,65.24 18.68,62.39 21.54,62.55 18.52,43.5 29.64,60.17 9.63,61.28 24.4,62.55 23.76,65.24 15.35,62.38 20.43,45.4 10.59,65.72 9.16,108.26 8.52,100.32 7.25,100.32 10.11,58.41 30.43,31.43 28.52,31.43 22.33,97.62 19.63,97.78 11.86,87.62 17.09,87.62 29.63,89.68 24.87,97.31 28.21,98.57
  pour Bottom (isolate 0.229, rank 3): 0.52,4.46 0.57,3.66 0.77,2.91 1.12,2.23 1.6,1.63 2.19,1.14 2.87,0.79 3.61,0.58 4.41,0.52 34.86,0.52 35.66,0.58 36.4,0.79 37.08,1.14 37.67,1.63 38.15,2.23 38.5,2.91 38.7,3.66 38.75,4.46 38.75,104.76 38.7,105.56 38.5,106.31 38.15,106.99 37.67,107.59 37.08,108.08 36.4,108.43 35.66,108.64 34.86,108.7 4.41,108.7 3.61,108.64 2.87,108.43 2.19,108.08 1.6,107.59 1.12,106.99 0.77,106.31 0.57,105.56 0.52,104.76
  pour Top (isolate 0.254, rank 3): 0.53,4.46 0.58,3.66 0.78,2.92 1.13,2.24 1.61,1.64 2.2,1.15 2.88,0.8 3.61,0.59 4.41,0.53 34.86,0.53 35.65,0.59 36.39,0.8 37.07,1.15 37.66,1.64 38.14,2.24 38.49,2.92 38.69,3.66 38.73,4.46 38.73,104.76 38.69,105.56 38.49,106.3 38.14,106.98 37.66,107.58 37.07,108.07 36.39,108.42 35.65,108.63 34.86,108.69 4.41,108.69 3.61,108.63 2.88,108.42 2.2,108.07 1.61,107.58 1.13,106.98 0.78,106.3 0.58,105.56 0.53,104.76
N$64  (via drill 0.38 pad 0.76)
  Top 0.381: v37.1,100.49 37.1,100.18 D7.3 | JP1.10 JP1.9
  Bottom 0.381: JP1.10 14.71,98.9 15.03,98.58 25.84,98.58 27.42,100.17 36.78,100.17 v37.1,100.49
Net_0  (via drill 0.38 pad 0.76)
  Top 0.203: J2.2 23.93,1.57 22.97,2.54 v22.97,17.6 22.97,19.53 23.45,20 R6.2 | v35.03,18.1 R5.2
  Bottom 0.203: v22.97,17.6 22.97,17.94 26.94,17.94 27.1,18.1 v35.03,18.1
Net_1  (via drill 0.38 pad 0.76)
  Top 0.203: R5.1 v35.19,20 | R2.2 v30.75,20.95 29.64,19.84 U3.6 | v27.41,20.95 27.41,20.16 C16.1
  Bottom 0.203: v35.19,20 35.19,20.16 34.72,20.64 31.06,20.64 v30.75,20.95 v27.41,20.95
Net_2  (via drill 0.38 pad 0.76)
  Top 0.203: U3.7 v28.37,17.11 28.37,17.31 C16.2 | v24.4,17.3 R6.1
  Bottom 0.203: v28.37,17.11 28.37,17.3 v24.4,17.3
Net_3
  Top 0.203: J3.2 15.18,1.57 16.14,2.54 16.14,6.03 15.82,6.35 R10.2 R9.2
Net_4
  Top 0.203: R9.1 9.88,4.45 | 9.88,4.45 R7.2 C17.1 | 9.88,4.45 9.88,7.22 9.16,7.94 9.16,9.37 U4.2
Net_5  (via drill 0.38 pad 0.76)
  Top 0.203: R10.1 14.24,4.45 v13.92,4.13 | v3.6,6.35 C17.2 | v8.05,8.26 U4.1
  Bottom 0.203: v13.92,4.13 5.82,4.13 v3.6,6.35 6.14,6.35 v8.05,8.26
Net_6  (via drill 0.38 pad 0.76)
  Top 0.203: v6.14,20.48 6.62,20 R12.2 5.19,20.16 4.55,20.16 3.44,19.05 3.44,17.78 1.06,15.4 1.06,5.86 J4.2 | v14.08,18.1 R11.2
  Bottom 0.203: v6.14,20.48 5.35,20.48 7.41,18.41 13.76,18.41 v14.08,18.1
Net_7  (via drill 0.38 pad 0.76)
  Top 0.203: R11.1 14.71,20 v15.51,20.8 | v11.86,20.95 11.86,20.16 R8.2 | v8.21,20.95 8.21,20.32 C18.1 8.68,20.16 9.32,20.16 9.63,19.84 9.63,16.83 10.59,15.88 U4.6
  Bottom 0.203: v15.51,20.8 12.02,20.8 v11.86,20.95 v8.21,20.95
Net_8  (via drill 0.38 pad 0.76)
  Top 0.203: C18.2 v8.52,17.14 9.32,16.35 U4.7 | v4.39,18.1 R12.1
  Bottom 0.203: v8.52,17.14 5.35,17.14 v4.39,18.1
Net_9
  Top 0.203: Q2.1 28.37,56.44 R18.2 R17.2
Net_10
  Top 0.203: R20.2 R19.2 7.89,56.44 Q3.1
Net_11  (via drill 0.38 pad 0.76)
  Top 0.203: Q4.1 9.95,43.66 v10.59,44.29 | v7.57,44.61 R22.2 | v4.39,44.61 4.39,43.81 R21.2
  Bottom 0.203: v10.59,44.29 7.89,44.29 v7.57,44.61 v4.39,44.61
Net_12  (via drill 0.38 pad 0.76)
  Top 0.203: v29.95,36.99 29.8,37.15 R28.1 29.8,36.04 U5.6 v29.8,32.7 | v28.37,37.15 C25.1 | R27.2 37.41,24.77 35.83,26.35 35.83,32.38 v35.67,32.54 | v21.22,32.54 21.22,32.07 R30.2
  Bottom 0.203: v29.95,36.99 28.52,36.99 v28.37,37.15 | v35.67,32.54 29.95,32.54 v29.8,32.7 25.51,32.7 25.03,33.18 21.86,33.18 v21.22,32.54
Net_13
  Top 0.508: C3.1 27.89,92.39 U7.3 30.91,93.03 31.38,93.49 32.33,93.49 32.81,93.02 U7.1 | L1.1 27.72,92.22 C3.1 | C3.1 26.78,92.23 C6.1
Net_18  (via drill 0.38 pad 0.76)
  Top 0.203: R34.2 18.05,24.77 v17.89,24.61 | v10.59,23.97 11.7,23.97 R32.1 | v7.25,23.97 8.43,23.97 C26.1 9.95,25.2 9.95,26.83 9.16,27.62 U10.2 | v1.7,25.4 R31.2
  Bottom 0.203: v17.89,24.61 16.94,24.61 16.3,23.97 v10.59,23.97 v7.25,23.97 4.08,23.97 2.65,25.4 v1.7,25.4
Net_19  (via drill 0.38 pad 0.76)
  Top 0.203: J1.2 36.77,1.57 38.37,3.17 38.37,6.35 R3.2 | v25.19,3.49 25.19,3.65 R4.2
  Bottom 0.203: J1.2 33.62,1.57 32.18,3.02 25.67,3.02 v25.19,3.49
Net_20  (via drill 0.38 pad 0.76)
  Top 0.203: C15.1 28.87,4.45 | 28.87,4.45 R1.2 31.86,4.45 v31.86,4.6 | v36.14,4.6 36.14,4.45 R3.1 | 28.87,4.45 28.87,7.28 28.21,7.94 28.21,9.21 U3.2
  Bottom 0.203: v31.86,4.6 v36.14,4.6
Net_21
  Top 0.203: U3.1 27.1,7.46 27.57,6.99 C15.2 R4.1
Net_22  (via drill 0.38 pad 0.76)
  Top 0.203: R35.2 2.17,19.84 2.97,20.64 2.97,31.75 2.33,32.38 2.33,35.88 2.97,36.51 v2.97,36.99 | v7.09,36.99 | v7.09,36.99 C27.1 | v10.59,36.99 R36.1 10.43,35.88 U10.6 | R38.2 17.73,32.07 v17.73,36.99
  Bottom 0.203: v2.97,36.99 v7.09,36.99 v10.59,36.99 v17.73,36.99
Net_35  (via drill 0.38 pad 0.76)
  Top 0.203: Q1.1 29,41.59 v28.68,41.27 | v32.49,40.8 32.49,41.6 R16.2 | v35.03,40.64 35.03,41.12 R15.2
  Bottom 0.203: v28.68,41.27 32.02,41.27 v32.49,40.8 34.88,40.8 v35.03,40.64
Net_39
  Top 0.203: J8.2 5.35,27.62 3.44,29.53 3.44,32.07 2.81,32.7 2.81,35.72 3.92,36.83 3.92,41.12 R21.1
Net_40  (via drill 0.38 pad 0.76)
  Top 0.203: J7.2 14.87,28.1 13.44,29.53 13.44,38.57 16.14,41.26 16.14,44.6 14.87,45.87 v14.87,49.85 | v10.74,50.01 10.27,50.01 R19.1
  Bottom 0.203: v14.87,49.85 10.74,49.85 v10.74,50.01
Net_41  (via drill 0.38 pad 0.76)
  Top 0.203: R17.1 30.27,50.32 v29.8,49.85 | v34.24,48.74 34.24,45.56 v34.08,45.4 | v31.06,45.24 31.06,40.8 32.34,39.53 v32.34,30.48
  Bottom 0.203: v29.8,49.85 30.27,49.85 30.91,50.48 32.49,50.48 v34.24,48.74 | v34.08,45.4 31.22,45.4 v31.06,45.24 | v32.34,30.48 27.59,30.48 J6.2
Net_42
  Top 0.203: J5.2 33.92,32.54 35.67,34.29 35.67,38.42 33.92,40.16 33.92,42.86 34.72,43.66 R15.1
Net_43  (via drill 0.38 pad 0.76)
  Top 0.203: R23.2 37.1,16.19 36.14,17.14 36.14,23.81 v35.99,23.97 | v32.18,24.13 31.38,24.13 C22.1 | R24.1 27.41,23.97 v28.84,23.97 28.84,28.26 U5.2 | v21.22,24.77 21.22,25.25 R26.2
  Bottom 0.203: v35.99,23.97 32.34,23.97 v32.18,24.13 29,24.13 v28.84,23.97 22.02,23.97 v21.22,24.77
Net_48  (via drill 0.38 pad 0.76)
  Top 0.203: R36.2 v10.75,38.89 | C27.2 v9.16,38.89 9.47,38.57 9.47,36.35 9.16,36.04 U10.7 | v1.54,37.47 R37.1
  Bottom 0.203: v10.75,38.89 v9.16,38.89 9.16,39.05 8.52,39.69 3.76,39.69 v1.54,37.47
Net_49  (via drill 0.38 pad 0.76)
  Top 0.203: R32.2 v11.54,26.67 | C26.2 8.56,25.71 v7.57,25.71 7.57,28.42 U10.1 7.57,28.73 v7.25,29.05 | v1.86,27.94 R33.1
  Bottom 0.203: v11.54,26.67 11.54,26.51 10.74,25.71 v7.57,25.71 | v7.25,29.05 2.97,29.05 v1.86,27.94
Net_50  (via drill 0.38 pad 0.76)
  Top 0.203: C25.2 28.37,39.05 v28.37,39.37 29.16,38.58 29.16,36.2 28.52,35.56 U5.7 | v30.11,39.53 30.43,39.53 R28.2 | v37.26,36.51 37.26,37.78 R29.1
  Bottom 0.203: v28.37,39.37 30.27,39.37 v30.11,39.53 30.75,39.53 30.91,39.69 34.72,39.69 35.99,38.42 35.99,37.78 v37.26,36.51
Net_51  (via drill 0.38 pad 0.76)
  Top 0.203: R24.2 27.73,26.51 v27.41,26.51 27.41,28.73 U5.1 | C22.2 v31.86,26.51 31.86,27.62 v32.97,28.73 | v36.62,28.57 37.57,28.57 R25.1
  Bottom 0.203: v27.41,26.51 v31.86,26.51 | v32.97,28.73 36.46,28.73 v36.62,28.57
Net_52  (via drill 0.38 pad 0.76)
  Top 0.203: v37.1,13.18 37.1,13.97 R23.1
  Bottom 0.203: J9.2 35.84,14.43 v37.1,13.18
Net_53  (via drill 0.38 pad 0.76)
  Top 0.203: v37.1,17.78 37.1,18.42 R27.1
  Bottom 0.203: J10.2 30.73,14.43 32.81,16.51 35.83,16.51 v37.1,17.78
Net_54  (via drill 0.38 pad 0.76)
  Top 0.203: v1.7,21.27 R31.1
  Bottom 0.203: J11.2 7.74,14.43 5.98,16.19 4.87,16.19 3.12,17.94 3.12,19.84 v1.7,21.27
Net_55  (via drill 0.38 pad 0.76)
  Top 0.203: v1.7,16.99 R35.1
  Bottom 0.203: J12.2 3.3,14.43 1.86,15.88 1.86,17.14 v1.7,16.99
Net_73  (via drill 0.38 pad 0.76)
  Top 1.778: R60.2 v31.22,95.72 | v16.47,94.13 17.26,94.13 C24.1 | IC6.2 2.97,98.7 v2.97,98.26 v2.97,99.53
  Bottom 1.778: v31.22,95.72 29.63,94.13 v16.47,94.13 12.18,98.42 3.13,98.42 v2.97,98.26
  pour Top (isolate 0.254): 1.98,100.03 4.11,100.03 4.11,97.27 1.98,97.27
Net_75  (via drill 0.38 pad 0.76)
  Top 0.203: R41.2 v15.51,70.8
  Bottom 0.203: U9.2 6.22,69.69 12.65,69.69 | 12.65,69.69 12.65,69.06 12.73,69.06 U9.1 | v15.51,70.8 15.51,70.33 14.87,69.69 12.65,69.69
Net_76  (via drill 0.38 pad 0.76)
  Top 0.203: v29.16,75.56 R40.2
  Bottom 0.203: U8.1 U8.2 30.45,74.28 v29.16,75.56 | U8.1
Net_88  (via drill 0.38 pad 0.76)
  Top 0.203: U12.2 v5.35,78.11 | v9,78.11 R53.2 10.27,76.52 9.16,75.41 RESET.1
  Bottom 0.203: v5.35,78.11 5.66,78.11 5.98,77.79 8.68,77.79 v9,78.11
Net_107  (via drill 0.38 pad 0.76)
  Top 0.381: JP1.2 JP1.1 | v34.08,102.7 34.7,102.08 D7.4
  Bottom 0.381: JP1.1 24.87,102.7 v34.08,102.7
RST  (via drill 0.38 pad 0.76)
  Top 0.203: v19.95,104.76 19.95,104.61 21.06,103.49 21.06,96.03 20.11,95.08 20.11,87.94 v22.49,85.56 | v23.44,80.49 23.44,66.79 U1.9
  Bottom 0.203: U11.5 19,104.76 v19.95,104.76 | v22.49,85.56 21.86,84.92 21.86,82.07 v23.44,80.49
RST_DAC  (via drill 0.38 pad 0.76)
  Top 0.203: U2.13 19,47.39 v19,46.04 | v28.52,48.42 27.41,49.53 27.41,59.69 29,61.28 29,66.31 U1.11
  Bottom 0.203: v19,46.04 22.97,46.04 25.51,48.58 28.37,48.58 v28.52,48.42
S$1  (via drill 0.38 pad 0.76)
  other vias: 2.17,46.04
SCK  (via drill 0.38 pad 0.76)
  Top 0.203: U2.10 21,49.14 v21.54,49.69 | v33.28,50.64 33.28,52.38 32.97,52.7 32.97,58.89 34.56,60.48 34.56,78.26 35.83,79.53 U1.20 | v37.89,84.93 38.05,84.93 38.53,85.41 38.53,103.02 v37.89,103.65
  Bottom 0.203: v21.54,49.69 21.7,49.69 23.12,51.11 32.65,51.11 33.13,50.64 v33.28,50.64 | U1.20 35.67,82.34 35.67,82.71 v37.89,84.93 | v37.89,103.65 27.09,103.65 26.14,104.61 24.24,104.61 U11.3
SW_B
  Top 0.203: R41.1 16.14,73.66 17.25,72.55 17.25,70.96 | 17.25,70.96 C31.1 | 17.25,70.96 16.3,70.01 16.3,67.1 U1.6
SW_L  (via drill 0.38 pad 0.76)
  Top 0.203: C29.1 v36.3,63.02 | v4.08,63.82 4.08,80.63 3.92,80.79 v3.92,81.27
  Bottom 0.203: v36.3,63.02 33.71,63.02 E1.4 32.3,61.95 30.75,63.5 4.39,63.5 v4.08,63.82 | v3.92,81.27 10.27,81.27 10.43,81.43 U1.30
SW_R  (via drill 0.38 pad 0.76)
  Top 0.203: E2.4 11.98,64.09 12.17,64.29 | 12.17,64.29 11.94,64.53 v12.33,64.92 | v32.02,64.61 32.02,67.93 31.22,68.73 31.22,75.88 33.29,77.95 U1.21 | C33.1 12.17,63.97 12.17,64.29
  Bottom 0.203: v12.33,64.92 12.65,64.92 13.12,64.45 31.86,64.45 v32.02,64.61
SW_T  (via drill 0.38 pad 0.76)
  Top 0.203: R40.1 28.05,72.07 v27.57,72.55 | v19.63,71.44 20.59,71.44 C30.1 18.05,68.9 U1.7
  Bottom 0.203: v27.57,72.55 20.75,72.55 v19.63,71.44
TR1  (via drill 0.38 pad 0.76)
  Top 0.203: Q1.3 27.5,43.89 v27.1,44.29 | v4.55,46.2 4.55,50.01 6.3,51.75 6.3,57.47 5.03,58.74 5.03,66.79 U1.2
  Bottom 0.203: v27.1,44.29 15.03,44.29 13.92,45.4 5.35,45.4 v4.55,46.2
TR2  (via drill 0.38 pad 0.76)
  Top 0.203: Q2.3 30.15,58.78 v30.27,58.9 | v5.67,59.85 5.67,64.77 7.73,66.83 7.73,66.94 U1.3
  Bottom 0.203: v30.27,58.9 20.59,58.9 19.64,59.85 v5.67,59.85
TR3
  Top 0.203: Q3.3 8.88,62.66 8.36,63.18 8.36,64.6 10.27,66.51 10.27,67.26 U1.4
TR4
  Top 0.203: Q4.3 12.33,42.55 12.33,45.39 13.29,46.34 13.29,50.32 11.86,51.75 11.86,58.1 11.7,58.26 11.7,59.21 12.33,59.84 13.44,59.84 13.92,60.32 13.92,65.71 12.53,67.1 U1.5
V_bias  (via drill 0.38 pad 0.76)
  Top 0.203: U3.3 29.64,10.79 30.91,12.06 U3.5 v31.03,16.03 | U4.3 10.59,11.11 11.86,12.38 U4.5 v11.86,16.67 | R13.1 v21.06,11.82 R14.2 | C21.1 v17.25,11.59 17.25,11.75 16.94,12.06 16.94,16.35 v17.25,16.67
  Bottom 0.203: v11.86,16.67 v17.25,16.67 27.57,16.67 28.21,16.03 v31.03,16.03 | v21.06,11.82 17.48,11.82 v17.25,11.59
VCC  (via drill 0.38 pad 0.76)
  Top 0.508: U3.8 v27.1,15.71 26.94,15.71 26.14,16.51 26.14,23.18 25.82,23.5 25.82,26.17 25.98,26.17 25.98,28.26 25.51,28.73 24.71,28.73 23.92,29.53 23.92,33.18 22.81,34.29 22.81,39.69 24.71,41.59 24.71,42.07 25.19,42.07 | U4.8 7.41,15.56 v7.41,15.71 6.94,16.19 4.72,16.19 C11.1 | C10.1 25.19,42.07 | 25.19,42.07 26.14,43.02 | 26.14,43.02 25.19,42.07 | D7.1 31.85,102.08 33.44,100.48 33.44,98.42 v35.03,96.83 35.03,95.88 R60.1 | 26.14,43.02 26.14,45.4 25.67,45.87 25.67,48.26 26.46,49.05 26.46,58.1 25.51,59.05 | 25.51,59.05 25.51,64.92 24.4,66.03 v24.4,85.09 | C1.1 25.51,58.82 25.51,59.05
  Bottom 0.508: v27.1,15.71 25.82,15.71 25.51,16.03 23.29,16.03 22.97,15.71 16.78,15.71 16.46,16.03 13.44,16.03 13.13,15.71 v7.41,15.71 | v24.4,85.09 30.28,85.09 35.19,90 35.19,96.67 v35.03,96.83
VEE  (via drill 0.38 pad 0.76)
  Top 0.203: C12.2 v19.63,7.94 | C28.1 14.87,44.76 15.27,44.36
  Top 0.508: U3.4 v31.54,9.37 31.54,9.21 34.24,6.51 C13.2 | v11.86,8.26 U4.4 11.86,11.27 12.81,12.22 12.81,15.4 13.29,15.88 13.29,28.42 12.81,28.89 12.81,39.04 15.51,41.74 15.51,44.12 15.27,44.36 13.92,44.36 13.92,50.64 12.49,52.07 v12.49,59.05 | v19.32,95.88 19.32,86.04 21.86,83.5 21.86,80.64 22.81,79.69 22.81,69.22 21.86,68.26 21.86,66.03 20.75,64.92 20.75,63.02 16.39,58.66 v16.39,59.05 C2.2 18.53,56.92 R39.1 | v29.63,97.62 29.63,98.42 D7.2
  Bottom 0.203: v19.63,7.94 19.63,8.1
  Bottom 0.508: v31.54,9.37 31.54,8.89 30.75,8.1 19.63,8.1 12.02,8.1 v11.86,8.26 | v12.49,59.05 v16.39,59.05 | v19.32,95.88 27.89,95.88 v29.63,97.62
VREF_2v5  (via drill 0.38 pad 0.76)
  Top 0.203: U2.3 18.39,33.62 19.16,32.86 19.16,22.38 v20.59,20.95 | v18.84,19.84 18.52,19.84 C19.1 18.21,15.08 C20.1 17.57,14.76 v19,14.76 | R13.2 21.22,15.24 21.86,14.6 v21.86,14.76
  Bottom 0.203: v20.59,20.95 19.95,20.95 19,20 19,19.68 v18.84,19.84 | v21.86,14.76 v19,14.76

### Text on the board
Top: JM
tPlace: JP1 | C32 | D7 | R42 | IC6 | EITHER WAY | R60 | C6 | L1 | C4 | C7 | C3 | U7 | C9 | ORIGINAL O_C BY MXMXMX | C24 | C14 | U12 | R53 | R41 | C31 | C30 | R40 | CC BY-SA 4.0 | C2 | C1 | U1 | C33 | C29 | Q3 | Q2 | R39 | R18 | R20 | R19 | C8 | U6 | R17 | ! | ! | R15 | Q4 | U2 | Q1 | C28 | R37 | R21 | R22 | C10 | R16 | C27 | R36 | C5 | C25 | R28 | R29 | R33 | C34 | C23 | R38 | R30 | C35 | U5 | R25 | U10 | R31 | R34 | R26 | C26 | R32 | R24 | C22 | C19 | R27 | R12 | C18 | R8 | R11 | R6 | C16 | R2 | R5 | R35 | R23 | C20 | R13 | U4 | U3 | C11 | C21 | R14 | R7 | R9 | R10 | R4 | R1 | R3 | C17 | C12 | C15 | C13
bPlace: ORIGINAL O_C BY MXMXMX | U11 | U9 | U8 | E2 | E1 | CC BY-SA 4.0 | J8 | J7 | J6 | J5 | J12 | J11 | J10 | J9 | J4 | J3 | J2 | J1
tDocu: JP1 | C32 | D7 | R42 | IC6 | R60 | C6 | L1 | C4 | C7 | C3 | U7 | C9 | C24 | C14 | U12 | R53 | R41 | C31 | C30 | R40 | C2 | C1 | U1 | C33 | C29 | Q3 | Q2 | R39 | R18 | R20 | R19 | C8 | U6 | R17 | R15 | Q4 | U2 | Q1 | C28 | R37 | R21 | R22 | C10 | R16 | C27 | R36 | C5 | C25 | R28 | R29 | R33 | C34 | C23 | R38 | R30 | C35 | U5 | R25 | U10 | R31 | R34 | R26 | C26 | R32 | R24 | C22 | C19 | R27 | R12 | C18 | R8 | R11 | R6 | C16 | R2 | R5 | R35 | R23 | C20 | R13 | U4 | U3 | C11 | C21 | R14 | R7 | R9 | R10 | R4 | R1 | R3 | C17 | C12 | C15 | C13
bDocu: U11 | U9 | U8 | E2 | E1 | J8 | J7 | J6 | J5 | J12 | J11 | J10 | J9 | J4 | J3 | J2 | J1